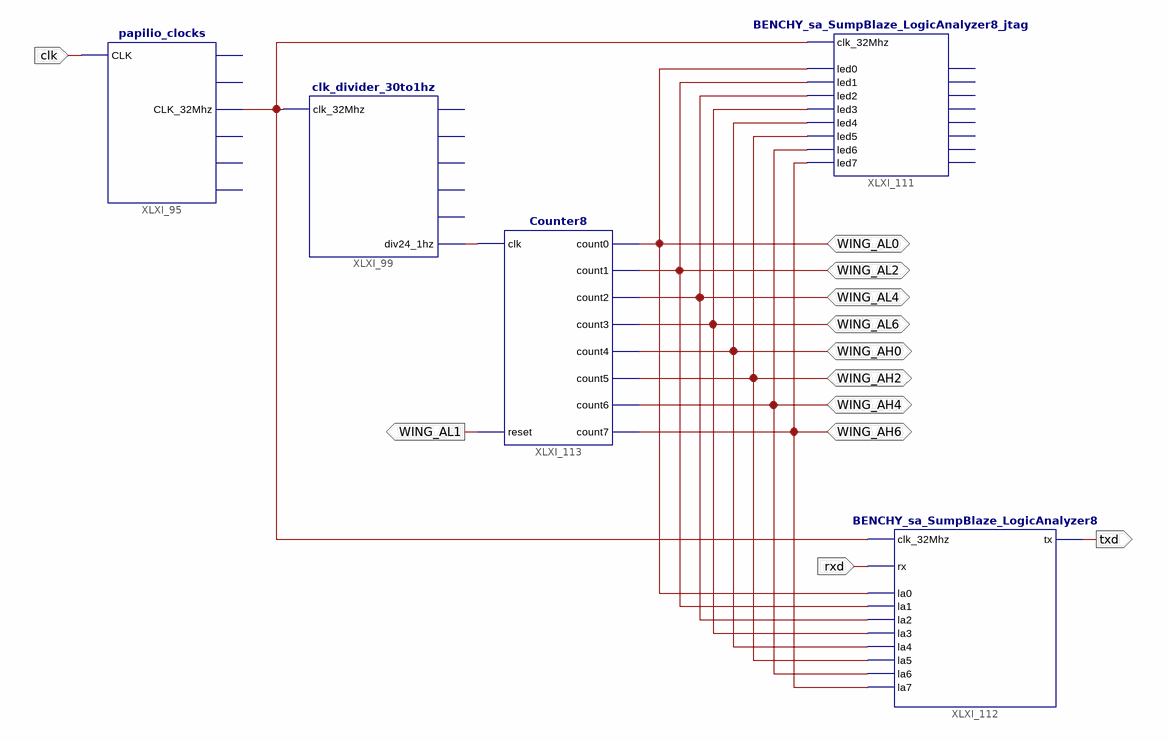
[diagram p0: schematic sheet 1]
// Xilinx ISE schematic Papilio_Pro.sch (spartan6) as structural Verilog: 5 symbols, 12 ports
module Papilio_Pro (
  input  clk,
  input  rxd,
  inout  WING_AH6,
  inout  WING_AH4,
  inout  WING_AH2,
  inout  WING_AH0,
  inout  WING_AL6,
  inout  WING_AL4,
  inout  WING_AL2,
  inout  WING_AL0,
  output txd,
  output WING_AL1
);

  wire XLXN_854, XLXN_863;

  papilio_clocks XLXI_95 (
    .CLK(clk), .CLK_32Mhz(XLXN_863));  // open: CLK_100Mhz, CLK_50Mhz, CLK_25Mhz, CLK_10Mhz, CLK_8Mhz
  clk_divider_30to1hz XLXI_99 (
    .clk_32Mhz(XLXN_863), .div24_1hz(XLXN_854));  // open: div19_30hz, div20_15hz, div21_8hz, div22_4hz, div23_2hz
  BENCHY_sa_SumpBlaze_LogicAnalyzer8_jtag XLXI_111 (
    .led0(WING_AL0), .led1(WING_AL2), .led2(WING_AL4), .led3(WING_AL6), .led4(WING_AH0), .led5(WING_AH2),
    .led6(WING_AH4), .led7(WING_AH6), .clk_32Mhz(XLXN_863));  // open: switch0, switch1, switch2, switch3, switch4, switch5, switch6, switch7
  BENCHY_sa_SumpBlaze_LogicAnalyzer8 XLXI_112 (
    .clk_32Mhz(XLXN_863), .la0(WING_AL0), .rx(rxd), .tx(txd), .la1(WING_AL2), .la2(WING_AL4), .la3(WING_AL6),
    .la4(WING_AH0), .la5(WING_AH2), .la6(WING_AH4), .la7(WING_AH6));
  Counter8 XLXI_113 (
    .clk(XLXN_854), .count0(WING_AL0), .count1(WING_AL2), .count2(WING_AL4), .count3(WING_AL6),
    .count4(WING_AH0), .count5(WING_AH2), .count6(WING_AH4), .count7(WING_AH6), .reset(WING_AL1));
endmodule
